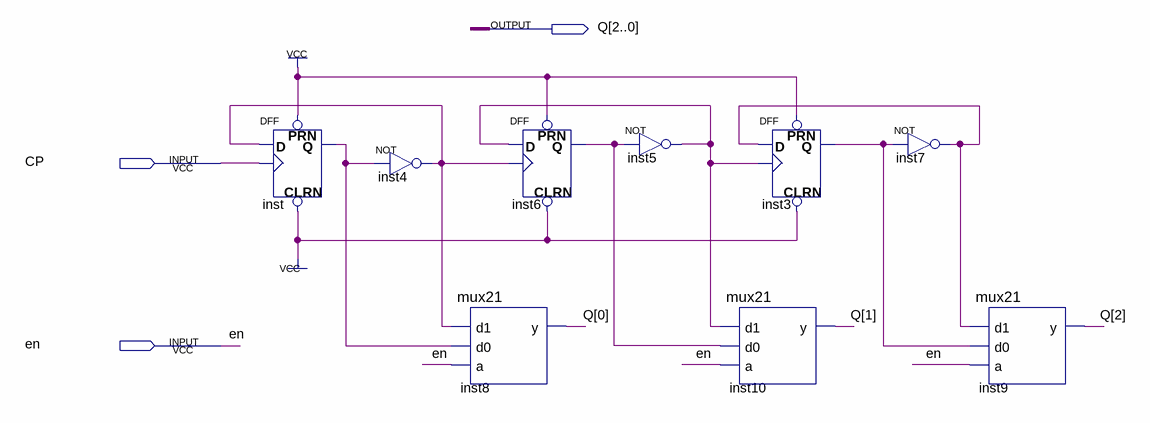
[diagram p0: schematic sheet]
// Quartus schematic lab3.bdf as structural Verilog: 9 symbols, 3 pins
module lab3 (
  input  CP,
  input  en,
  output [2:0] Q
);

  wire inst3_q, inst4_out, inst5_out, inst6_q, inst7_out, inst_q;

  DFF inst (.CLRN(1'b1), .CLK(CP), .D(inst4_out), .PRN(1'b1), .Q(inst_q));
  not inst4 (inst4_out, inst_q);
  mux21 inst8 (.d1(inst4_out), .d0(inst_q), .a(en), .y(Q[0]));
  DFF inst6 (.CLRN(1'b1), .CLK(inst4_out), .D(inst5_out), .PRN(1'b1), .Q(inst6_q));
  not inst5 (inst5_out, inst6_q);
  DFF inst3 (.CLRN(1'b1), .CLK(inst5_out), .D(inst7_out), .PRN(1'b1), .Q(inst3_q));
  mux21 inst10 (.d1(inst5_out), .d0(inst6_q), .a(en), .y(Q[1]));
  not inst7 (inst7_out, inst3_q);
  mux21 inst9 (.d1(inst7_out), .d0(inst3_q), .a(en), .y(Q[2]));
endmodule
